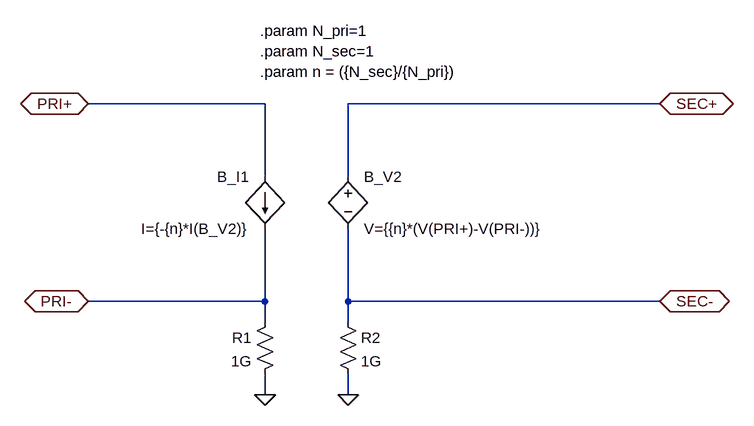
[diagram p0: schematic IDEAL_DC_XFMR_ALT.asc]
IDEAL_DC_XFMR_ALT.asc, the LTspice schematic file:
Version 4.1
SHEET 1 996 680
WIRE 192 112 -80 112
WIRE 800 112 320 112
WIRE 192 224 192 112
WIRE 320 224 320 112
WIRE 192 416 192 304
WIRE 192 416 -80 416
WIRE 320 416 320 304
WIRE 800 416 320 416
WIRE 192 448 192 416
WIRE 320 448 320 416
WIRE 192 560 192 528
WIRE 320 560 320 528
FLAG -80 112 PRI+
IOPIN -80 112 BiDir
FLAG -80 416 PRI-
IOPIN -80 416 BiDir
FLAG 800 112 SEC+
IOPIN 800 112 BiDir
FLAG 800 416 SEC-
IOPIN 800 416 BiDir
FLAG 320 560 0
FLAG 192 560 0
SYMBOL bv 320 208 R0
SYMATTR InstName B_V2
SYMATTR Value V={{n}*(V(PRI+)-V(PRI-))}
SYMBOL bi 192 224 M0
SYMATTR InstName B_I1
SYMATTR Value I={-{n}*I(B_V2)}
SYMBOL res 208 432 M0
SYMATTR InstName R1
SYMATTR Value 1G
SYMBOL res 304 432 R0
SYMATTR InstName R2
SYMATTR Value 1G
TEXT 184 0 Left 2 !.param N_pri=1\n.param N_sec=1\n.param n = ({N_sec}/{N_pri})

The netlist it stands for:
* IDEAL_DC_XFMR_ALT.asc
B_V2 SEC+ SEC- V={{n}*(V(PRI+)-V(PRI-))}
B_I1 PRI+ PRI- I={-{n}*I(B_V2)}
R1 PRI- 0 1G
R2 SEC- 0 1G
.param N_pri=1
.param N_sec=1
.param n = ({N_sec}/{N_pri})
.backanno
.end